# Altium schematic sheet fpga-bank4-inside.SchDoc: FPGA - Bank 4
size Letter; CheckedBy: E. Chiu; CompanyName: Brinton Engineering, LLC; DrawnBy: J. Brinton; Engineer: J. Brinton; Address1: 3479 Edison Way; Address2: Menlo Park CA 94025; Address3: +1 (877) 778-8435; Address4: brintonengineering.com; Revision: 1; SheetNumber: 24; SheetTotal: 60
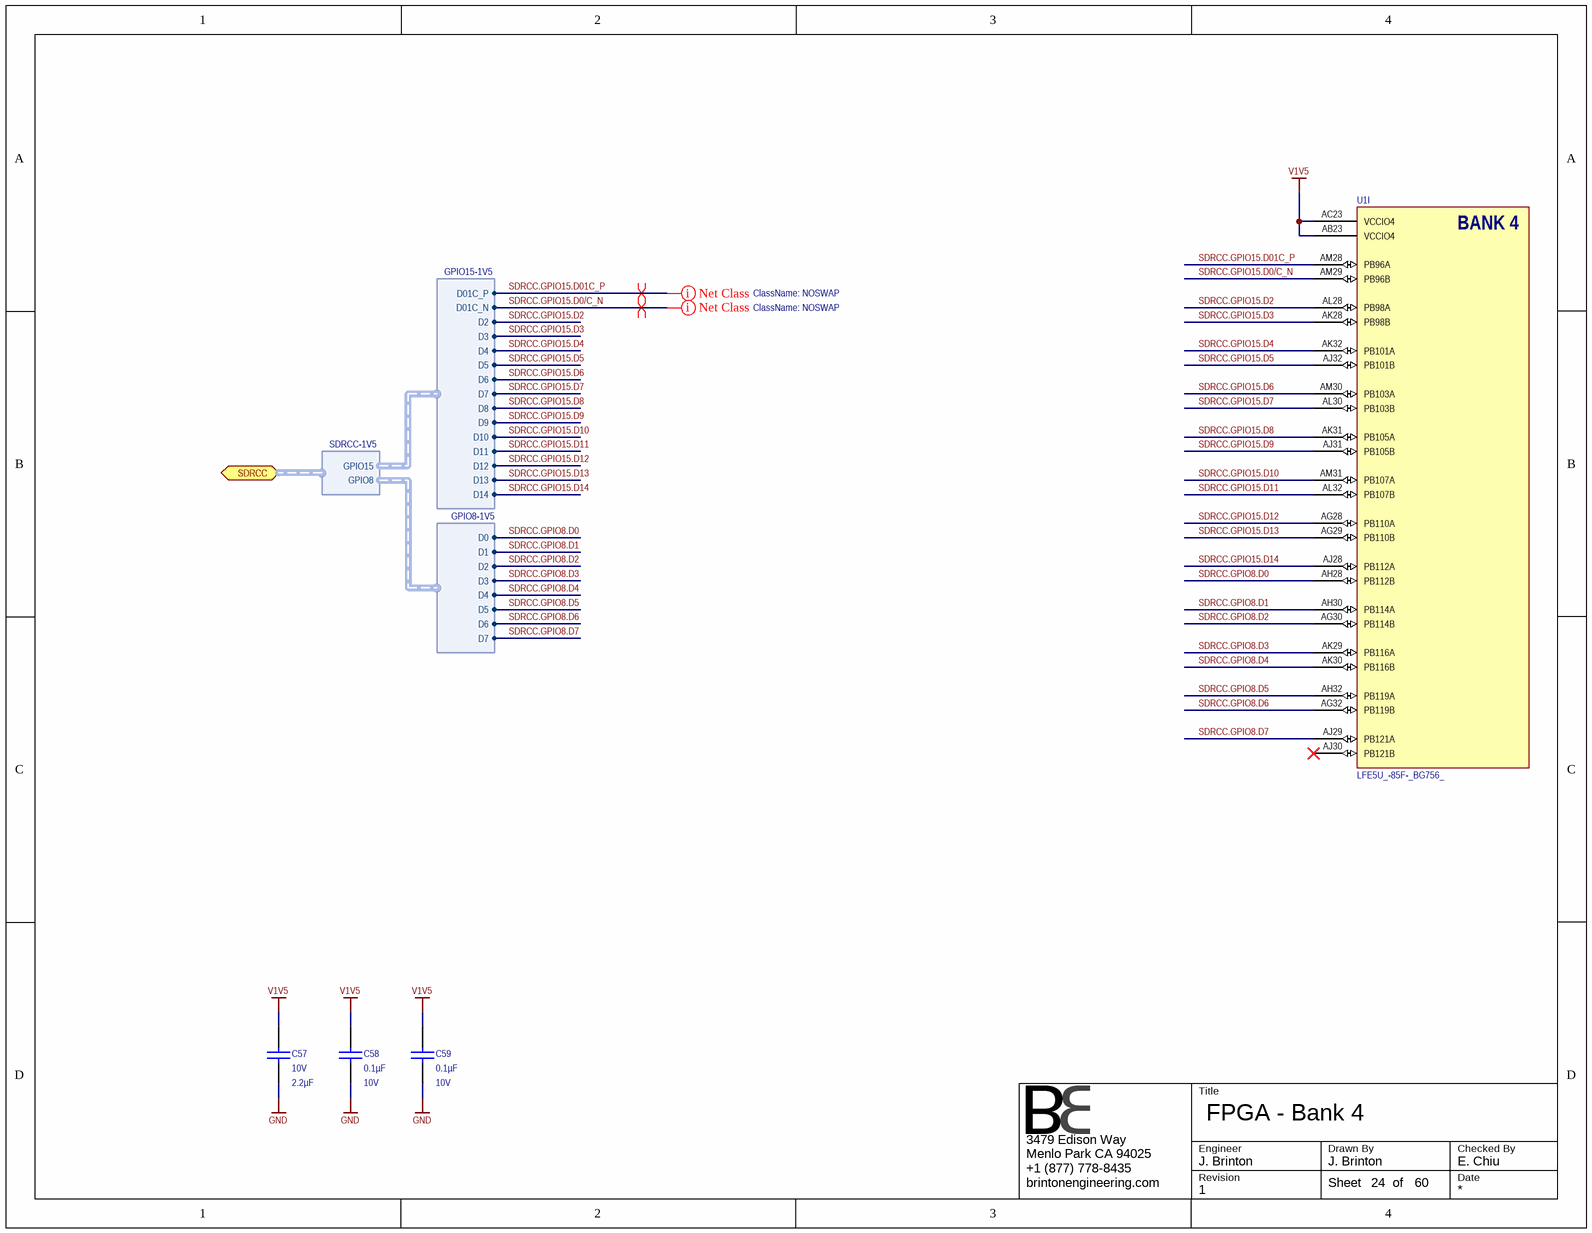
[diagram p0: fpga-bank4-inside.SchDoc]

## Parts
C57  Voltage - Rated: 10V  Capacitance: 2.2µF  [CAPC1608X90N]  (hidden comment: GRM188R71A225KE15D)
C58  Capacitance: 0.1µF  Voltage - Rated: 10V  [CAPC1005X56N]  (hidden comment: GRM155R71A104KA01J)
C59  Capacitance: 0.1µF  Voltage - Rated: 10V  [CAPC1005X56N]  (hidden comment: GRM155R71A104KA01J)
U1  LFE5U_-85F-_BG756_  [caBGA756]  (part I of 19)

## Ports
SDRCC (harness SDRCC-1V5)

## Harnesses
GPIO8-1V5: D0, D1, D2, D3, D4, D5, D6, D7
GPIO15-1V5: D01C_P, D01C_N, D2, D3, D4, D5, D6, D7, D8, D9, D10, D11, D12, D13, D14
SDRCC-1V5: GPIO15, GPIO8

## Nets
GND: C57.1 C58.1 C59.1
V1V5: C57.2 C58.2 C59.2 U1.AB23(VCCIO4) U1.AC23(VCCIO4)
SDRCC.GPIO8.D0: U1.AH28(PB112B) ; harness GPIO8-1V5.D0
SDRCC.GPIO8.D1: U1.AH30(PB114A) ; harness GPIO8-1V5.D1
SDRCC.GPIO8.D2: U1.AG30(PB114B) ; harness GPIO8-1V5.D2
SDRCC.GPIO8.D3: U1.AK29(PB116A) ; harness GPIO8-1V5.D3
SDRCC.GPIO8.D4: U1.AK30(PB116B) ; harness GPIO8-1V5.D4
SDRCC.GPIO8.D5: U1.AH32(PB119A) ; harness GPIO8-1V5.D5
SDRCC.GPIO8.D6: U1.AG32(PB119B) ; harness GPIO8-1V5.D6
SDRCC.GPIO8.D7: U1.AJ29(PB121A) ; harness GPIO8-1V5.D7
SDRCC.GPIO15.D0/C_N: U1.AM29(PB96B) ; harness GPIO15-1V5.D01C_N
SDRCC.GPIO15.D01C_P: U1.AM28(PB96A) ; harness GPIO15-1V5.D01C_P
SDRCC.GPIO15.D2: U1.AL28(PB98A) ; harness GPIO15-1V5.D2
SDRCC.GPIO15.D3: U1.AK28(PB98B) ; harness GPIO15-1V5.D3
SDRCC.GPIO15.D4: U1.AK32(PB101A) ; harness GPIO15-1V5.D4
SDRCC.GPIO15.D5: U1.AJ32(PB101B) ; harness GPIO15-1V5.D5
SDRCC.GPIO15.D6: U1.AM30(PB103A) ; harness GPIO15-1V5.D6
SDRCC.GPIO15.D7: U1.AL30(PB103B) ; harness GPIO15-1V5.D7
SDRCC.GPIO15.D8: U1.AK31(PB105A) ; harness GPIO15-1V5.D8
SDRCC.GPIO15.D9: U1.AJ31(PB105B) ; harness GPIO15-1V5.D9
SDRCC.GPIO15.D10: U1.AM31(PB107A) ; harness GPIO15-1V5.D10
SDRCC.GPIO15.D11: U1.AL32(PB107B) ; harness GPIO15-1V5.D11
SDRCC.GPIO15.D12: U1.AG28(PB110A) ; harness GPIO15-1V5.D12
SDRCC.GPIO15.D13: U1.AG29(PB110B) ; harness GPIO15-1V5.D13
SDRCC.GPIO15.D14: U1.AJ28(PB112A) ; harness GPIO15-1V5.D14

Not connected (* = marked no-connect by the designer): U1 AJ30(PB121B)*

## Layout directives
net class NOSWAP: SDRCC.GPIO15.D0/C_N, SDRCC.GPIO15.D01C_P
differential pair: SDRCC.GPIO15.D0/C_N, SDRCC.GPIO15.D01C_P

## Notes on the sheet
- Title
- Engineer
- Revision
- Drawn By
- Checked By
- Date
- Sheet
- of
- (in symbol LFE5U_-85F-_BG756_, part I) BANK 4

## Library data of the parts
C57 = GRM188R71A225KE15D: CAP CER 2.2UF 10V 10% X7R 0603; Manufacturer: Murata Electronics North America; Manufacturer P/N: GRM188R71A225KE15D; Operating Temperature: -55°C ~ 125°C; Thickness (Max): 0.035" (0.90mm); Tolerance: ±10%; Package / Case: 0603 (1608 Metric); Temperature Coefficient: X7R; Supplier 1: Newark; Supplier 2: Digi-Key; RoHS: RoHS Compliant; Size / Dimension: 0.063" L x 0.031" W (1.60mm x 0.80mm); Mounting Type: Surface Mount, MLCC; ComponentLink1URL: http://www.murata.com/~/media/webrenewal/support/library/catalog/products/capacitor/mlcc/c02e.ashx; ComponentLink1Description: http://www.murata.com/~/media/webrenewal/support/library/catalog/products/capacitor/mlcc/c02e.ashx; Supplier Part Number 1: 72R4209; Supplier Part Number 2: 490-4520-1-ND
C58 C59 = GRM155R71A104KA01J: CAP CER 0.1UF 10V 10% X7R 0402; Manufacturer: Murata Electronics North America; Manufacturer P/N: GRM155R71A104KA01J; Operating Temperature: -55°C ~ 125°C; Thickness (Max): 0.022" (0.55mm); Size / Dimension: 0.039" L x 0.020" W (1.00mm x 0.50mm); RoHS: RoHS Compliant; Mounting Type: Surface Mount, MLCC; Supplier 1: Digi-Key; ComponentLink1URL: http://www.murata.com/~/media/webrenewal/support/library/catalog/products/capacitor/mlcc/c02e.ashx; ComponentLink1Description: http://www.murata.com/~/media/webrenewal/support/library/catalog/products/capacitor/mlcc/c02e.ashx; Supplier Part Number 1: 490-6322-1-ND; Temperature Coefficient: X7R; Package / Case: 0402 (1005 Metric); Tolerance: ±10%
U1 = LFE5U_-85F-_BG756_: ECP5 FPGA, 85k LUT, 756-caBGA; Manufacturer: Lattice Semiconductor; Manufacturer P/N: LFE5U_-85F-_BG756_